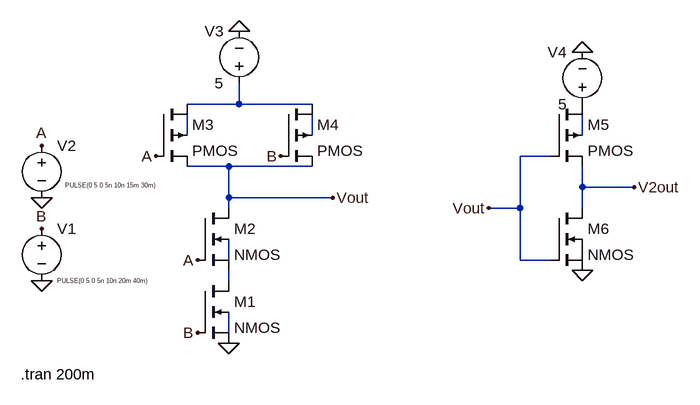
[diagram p0: schematic CMOS_AND_NAND.asc]
CMOS_AND_NAND.asc, the LTspice schematic file:
Version 4
SHEET 1 880 680
WIRE 160 -80 160 -112
WIRE 160 -80 80 -80
WIRE 272 -80 160 -80
WIRE 80 -32 80 -64
WIRE 272 -32 272 -64
WIRE 688 -32 688 -64
WIRE 640 0 592 0
WIRE 144 16 80 16
WIRE 272 16 144 16
WIRE 688 48 688 16
WIRE 768 48 688 48
WIRE 144 64 144 16
WIRE 304 64 144 64
WIRE 144 80 144 64
WIRE 592 80 592 0
WIRE 592 80 544 80
WIRE 688 80 688 48
WIRE 144 160 144 128
WIRE 592 160 592 80
WIRE 640 160 592 160
WIRE 144 192 144 176
WIRE 144 272 144 240
FLAG -144 64 0
FLAG -144 192 0
FLAG -144 -16 A
FLAG -144 112 B
FLAG 96 160 A
FLAG 96 272 B
FLAG 32 0 A
FLAG 224 0 B
FLAG 160 -192 0
FLAG 144 288 0
FLAG 304 64 Vout
FLAG 688 176 0
FLAG 688 -160 0
FLAG 544 80 Vout
FLAG 768 48 V2out
SYMBOL nmos4 96 192 R0
SYMATTR InstName M1
SYMBOL nmos4 96 80 R0
SYMATTR InstName M2
SYMBOL pmos4 32 -80 R0
SYMATTR InstName M3
SYMBOL pmos4 224 -80 R0
SYMATTR InstName M4
SYMBOL voltage -144 96 R0
WINDOW 3 24 96 Left 0
WINDOW 123 0 0 Left 0
WINDOW 39 0 0 Left 0
SYMATTR InstName V1
SYMATTR Value PULSE(0 5 0 5n 10n 20m 40m)
SYMBOL voltage -144 -32 R0
WINDOW 3 36 77 Left 0
WINDOW 123 0 0 Left 0
WINDOW 39 0 0 Left 0
SYMATTR InstName V2
SYMATTR Value PULSE(0 5 0 5n 10n 15m 30m)
SYMBOL voltage 160 -96 R180
WINDOW 0 24 96 Left 2
WINDOW 3 24 16 Left 2
WINDOW 123 0 0 Left 0
WINDOW 39 0 0 Left 0
SYMATTR InstName V3
SYMATTR Value 5
SYMBOL pmos4 640 -80 R0
SYMATTR InstName M5
SYMBOL nmos 640 80 R0
SYMATTR InstName M6
SYMBOL voltage 688 -64 R180
WINDOW 0 24 96 Left 2
WINDOW 3 24 16 Left 2
WINDOW 123 0 0 Left 0
WINDOW 39 0 0 Left 0
SYMATTR InstName V4
SYMATTR Value 5
TEXT -176 336 Left 2 !.tran 200m

The netlist it stands for:
* CMOS_AND_NAND.asc
M1 N006 B 0 N007 NMOS
M2 Vout A N006 N005 NMOS
M3 N001 A Vout N002 PMOS
M4 N001 B Vout N003 PMOS
V1 B 0 PULSE(0 5 0 5n 10n 20m 40m)
V2 A 0 PULSE(0 5 0 5n 10n 15m 30m)
V3 N001 0 5
M5 P001 Vout V2out N004 PMOS
M6 V2out Vout 0 0 NMOS
V4 P001 0 5
.model NMOS NMOS
.model PMOS PMOS
.lib standard.mos
.tran 200m
.backanno
.end